# EAGLE design ccam (EAGLE 8.6.1)
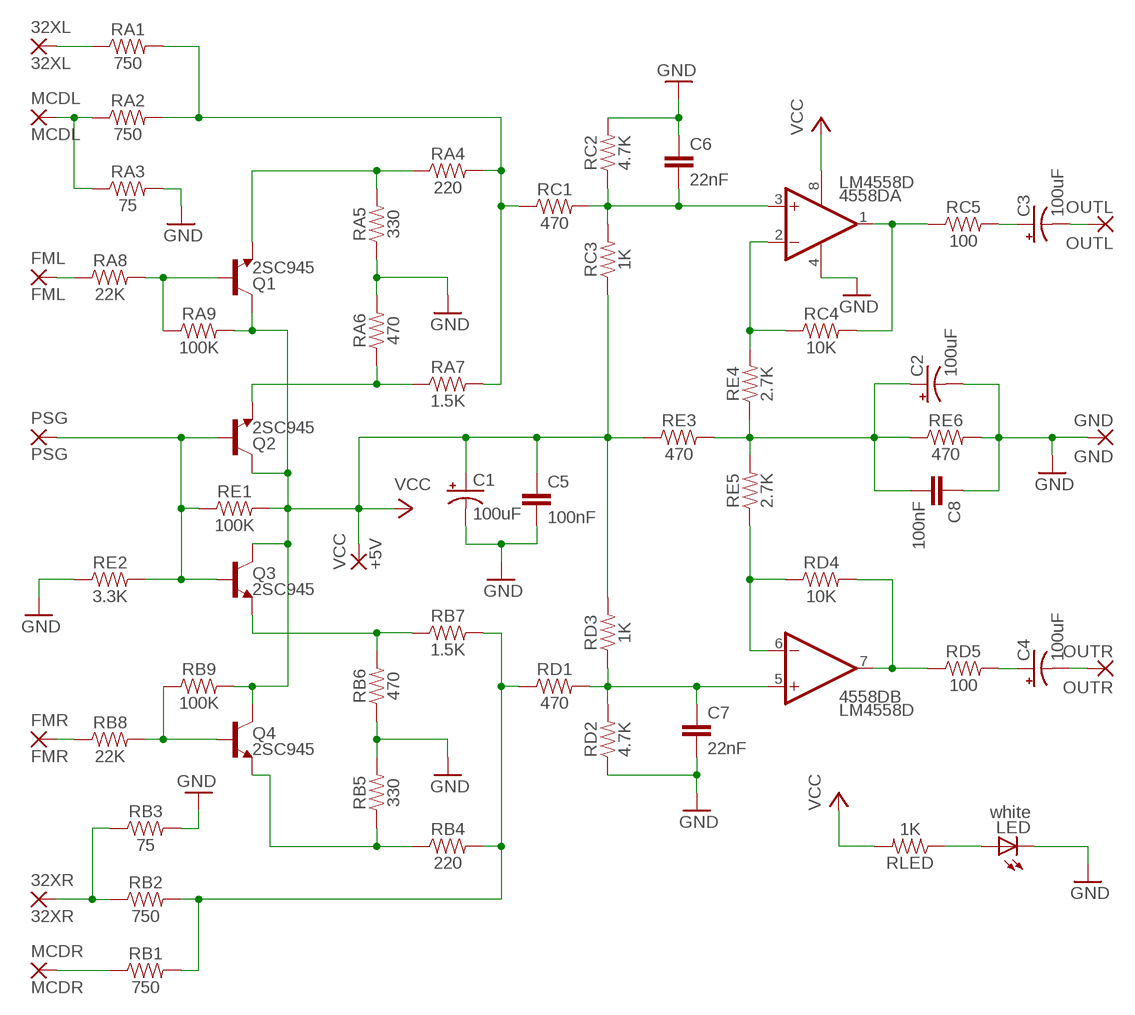
[diagram p0: schematic, sheet 1]

## Parts
32XL  32XL  SMD2  [SMD1,27-2,54]
32XR  32XR  SMD2  [SMD1,27-2,54]
4558D  LM4558D  [SO08]
C1  100uF  10UF-POLAR-EIA6032-25V-10%  [EIA6032-NOM]
C2  100uF  10UF-POLAR-EIA6032-25V-10%  [EIA6032-NOM]
C3  100uF  10UF-POLAR-EIA6032-25V-10%  [EIA6032-NOM]
C4  100uF  10UF-POLAR-EIA6032-25V-10%  [EIA6032-NOM]
C5  100nF  1.0UF-0805-25V-(+80/-20%)  [0805]
C6  22nF  1.0UF-0805-25V-(+80/-20%)  [0805]
C7  22nF  1.0UF-0805-25V-(+80/-20%)  [0805]
C8  100nF  1.0UF-0805-25V-(+80/-20%)  [0805]
FML  FML  SMD2  [SMD1,27-2,54]
FMR  FMR  SMD2  [SMD1,27-2,54]
GND  GND  SMD2  [SMD1,27-2,54]
LED  white  LEDCHIP-LED0805  [CHIP-LED0805]
MCDL  MCDL  SMD2  [SMD1,27-2,54]
MCDR  MCDR  SMD2  [SMD1,27-2,54]
OUTL  OUTL  SMD2  [SMD1,27-2,54]
OUTR  OUTR  SMD2  [SMD1,27-2,54]
PSG  PSG  SMD2  [SMD1,27-2,54]
Q1  2SC945  TRANS_NPN-MMBT2222AL  [SOT23-3]
Q2  2SC945  TRANS_NPN-MMBT2222AL  [SOT23-3]
Q3  2SC945  TRANS_NPN-MMBT2222AL  [SOT23-3]
Q4  2SC945  TRANS_NPN-MMBT2222AL  [SOT23-3]
RA1  750  0.22OHM-0805-1/4W-1%  [0805]
RA2  750  0.22OHM-0805-1/4W-1%  [0805]
RA3  75  0.22OHM-0805-1/4W-1%  [0805]
RA4  220  0.22OHM-0805-1/4W-1%  [0805]
RA5  330  0.22OHM-0805-1/4W-1%  [0805]
RA6  470  0.22OHM-0805-1/4W-1%  [0805]
RA7  1.5K  0.22OHM-0805-1/4W-1%  [0805]
RA8  22K  0.22OHM-0805-1/4W-1%  [0805]
RA9  100K  0.22OHM-0805-1/4W-1%  [0805]
RB1  750  0.22OHM-0805-1/4W-1%  [0805]
RB2  750  0.22OHM-0805-1/4W-1%  [0805]
RB3  75  0.22OHM-0805-1/4W-1%  [0805]
RB4  220  0.22OHM-0805-1/4W-1%  [0805]
RB5  330  0.22OHM-0805-1/4W-1%  [0805]
RB6  470  0.22OHM-0805-1/4W-1%  [0805]
RB7  1.5K  0.22OHM-0805-1/4W-1%  [0805]
RB8  22K  0.22OHM-0805-1/4W-1%  [0805]
RB9  100K  0.22OHM-0805-1/4W-1%  [0805]
RC1  470  0.22OHM-0805-1/4W-1%  [0805]
RC2  4.7K  0.22OHM-0805-1/4W-1%  [0805]
RC3  1K  0.22OHM-0805-1/4W-1%  [0805]
RC4  10K  0.22OHM-0805-1/4W-1%  [0805]
RC5  100  0.22OHM-0805-1/4W-1%  [0805]
RD1  470  0.22OHM-0805-1/4W-1%  [0805]
RD2  4.7K  0.22OHM-0805-1/4W-1%  [0805]
RD3  1K  0.22OHM-0805-1/4W-1%  [0805]
RD4  10K  0.22OHM-0805-1/4W-1%  [0805]
RD5  100  0.22OHM-0805-1/4W-1%  [0805]
RE1  100K  0.22OHM-0805-1/4W-1%  [0805]
RE2  3.3K  0.22OHM-0805-1/4W-1%  [0805]
RE3  470  0.22OHM-0805-1/4W-1%  [0805]
RE4  2.7K  0.22OHM-0805-1/4W-1%  [0805]
RE5  2.7K  0.22OHM-0805-1/4W-1%  [0805]
RE6  470  0.22OHM-0805-1/4W-1%  [0805]
RLED  1K  0.22OHM-0805-1/4W-1%  [0805]
VCC  +5V  SMD2  [SMD1,27-2,54]

## Nets
GND: 4558D.4(P:V-) C1.C(-) C2.C(-) C5.2 C6.1 C7.2 C8.1 GND.1(P) LED.C RA3.2 RA5.1 RA6.2 RB3.2 RB5.2 RB6.1 RC2.2 RD2.1 RE2.1 RE6.2
N$1: 32XL.1(P) RA1.1
N$2: MCDL.1(P) RA2.1 RA3.1
N$3: RA1.2 RA2.2 RA4.2 RA7.2 RC1.1
N$4: FML.1(P) RA8.1
N$5: Q1.1(B) RA8.2 RA9.1
N$6: Q4.1(B) RB8.2 RB9.1
N$7: PSG.1(P) Q2.1(B) Q3.1(B) RE1.1 RE2.2
N$8: Q1.2(E) RA4.1 RA5.2
N$9: FMR.1(P) RB8.1
N$10: Q2.2(E) RA6.1 RA7.1
N$11: MCDR.1(P) RB1.1
N$12: 32XR.1(P) RB2.1 RB3.1
N$13: RB1.2 RB2.2 RB4.2 RB7.2 RD1.1
N$14: Q3.2(E) RB6.2 RB7.1
N$15: 4558D.3(A:+IN) C6.2 RC1.2 RC2.1 RC3.2
N$16: Q4.2(E) RB4.1 RB5.1
N$17: 4558D.5(B:+IN) C7.1 RD1.2 RD2.2 RD3.1
N$18: 4558D.2(A:-IN) RC4.1 RE4.2
N$19: C2.A(+) C8.2 RE3.2 RE4.1 RE5.2 RE6.1
N$20: C4.A(+) RD5.2
N$21: 4558D.1(A:OUT) RC4.2 RC5.1
N$22: C3.A(+) RC5.2
N$23: C3.C(-) OUTL.1(P)
N$24: C4.C(-) OUTR.1(P)
N$25: LED.A RLED.1
N$26: 4558D.7(B:OUT) RD4.2 RD5.1
N$27: 4558D.6(B:-IN) RD4.1 RE5.1
VCC: 4558D.8(P:V+) C1.A(+) C5.1 Q1.3(C) Q2.3(C) Q3.3(C) Q4.3(C) RA9.2 RB9.2 RC3.1 RD3.2 RE1.2 RE3.1 RLED.2 VCC.1(P)

## Library data of the parts
32XL 32XR FML FMR GND MCDL MCDR OUTL OUTR PSG VCC = wirepad:SMD2: SMD PAD
4558D = linear:*4558: OP AMP
C1-C4 = SparkFun-Capacitors:10UF-POLAR: 10.0µF polarized capacitors A capacitor is a passive two-terminal electrical component used to store electrical energy temporarily in an electric field.; PROD_ID: CAP-12984; VALUE: 10µF
C5-C8 = SparkFun-Capacitors:1.0UF: 1µF ceramic capacitors A capacitor is a passive two-terminal electrical component used to store electrical energy temporarily in an electric field.; PROD_ID: CAP-11625; VALUE: 1.0uF
LED = led:LED: LED OSRAM: - CHIPLED LG R971, LG N971, LY N971, LG Q971, LY Q971, LO R971, LY R971 LH N974, LH R974 LS Q976, LO Q976, LY Q976 LO Q996 - Hyper CHIPLED LW Q18S LB Q993, LB Q99A, LB R99A - SideLED LS A670, LO A670, LY A670, LG A670, LP A670 LB A673, LV A673, LT A673, LW A673 LH A674 LY A675 LS A676, LA A676, LO A676, LY A676, LW A676 LS A679, LY A679, LG A679 - Hyper Micro SIDELED® LS Y876, LA Y876, LO Y876, LY Y876 LT Y87S - SmartLED LW L88C, LW L88S LB L89C, LB L89S, LG L890 LS L89K, LO L89K, LY L89K LS L896, LA L896, LO L896, LY L896 - TOPLED LS T670, LO T670, LY T670, LG T670, LP T670 LSG T670, LSP T670, LSY T670, LOP T670, LYG T670 LG T671, LOG T671, LSG T671 LB T673, LV T673, LT T673, LW T673 LH T674 LS T676, LA T676, LO T676, LY T676, LB T676, LH T676, LSB T676, LW T676 LB T67C, LV T67C, LT T67C, LS T67K, LO T67K, LY T67K, LW E67C LS E67B, LA E67B, LO E67B, LY E67B, LB E67C, LV E67C, LT E67C LW T67C LS T679, LY T679, LG T679 LS T770, LO T770, LY T770, LG T770, LP T770 LB T773, LV T773, LT T773, LW T773 LH T774 LS E675, LA E675, LY E675, LS T675 LS T776, LA T776, LO T776, LY T776, LB T776 LHGB T686 LT T68C, LB T68C - Hyper Mini TOPLED® LB M676 - Mini TOPLED Santana® LG M470 LS M47K, LO M47K, LY M47K Source: http://www.osram.convergy.de LUXEON: - LUMILED® LXK2-PW12-R00, LXK2-PW12-S00, LXK2-PW14-U00, LXK2-PW14-V00 LXK2-PM12-R00, LXK2-PM12-S00, LXK2-PM14-U00 LXK2-PE12-Q00, LXK2-PE12-R00, LXK2-PE12-S00, LXK2-PE14-T00, LXK2-PE14-U00 LXK2-PB12-K00, LXK2-PB12-L00, LXK2-PB12-M00, LXK2-PB14-N00, LXK2-PB14-P00, LXK2-PB14-Q00 LXK2-PR12-L00, LXK2-PR12-M00, LXK2-PR14-Q00, LXK2-PR14-R00 LXK2-PD12-Q00, LXK2-PD12-R00, LXK2-PD12-S00 LXK2-PH12-R00, LXK2-PH12-S00 LXK2-PL12-P00, LXK2-PL12-Q00, LXK2-PL12-R00 Source: www.luxeon.com KINGBRIGHT: KA-3528ASYC Source: www.kingbright.com
Q1-Q4 = SparkFun-DiscreteSemi:TRANS_NPN: NPN transistor Current controlled devices typically used to amplify current or used as a switch. BC547 - COM-08928 <http://www.sparkfun.com/products/8928> (TO-92 45V 100mA) (1.Collector 2.Base 3.Emitter) 2N3904 - COM-00521 <http://www.sparkfun.com/products/521> (TO-92 40V 200mA) (1.Emitter 2.Base 3.Collector) P2N2222A - COM-12852 <http://www.sparkfun.com/products/12852> (TO-92 40V 600mA) (1.Collector 2.Base 3.Emitter); PROD_ID: TRANS-08049; VALUE: 600mA/40V
RA1-RA9 RB1-RB9 RC1-RC5 RD1-RD5 RE1-RE6 RLED = SparkFun-Resistors:0.22OHM: 0.22Ω resistor A resistor is a passive two-terminal electrical component that implements electrical resistance as a circuit element. Resistors act to reduce current flow, and, at the same time, act to lower voltage levels within circuits. - Wikipedia; PROD_ID: RES-09883; VALUE: 0.22

## Board
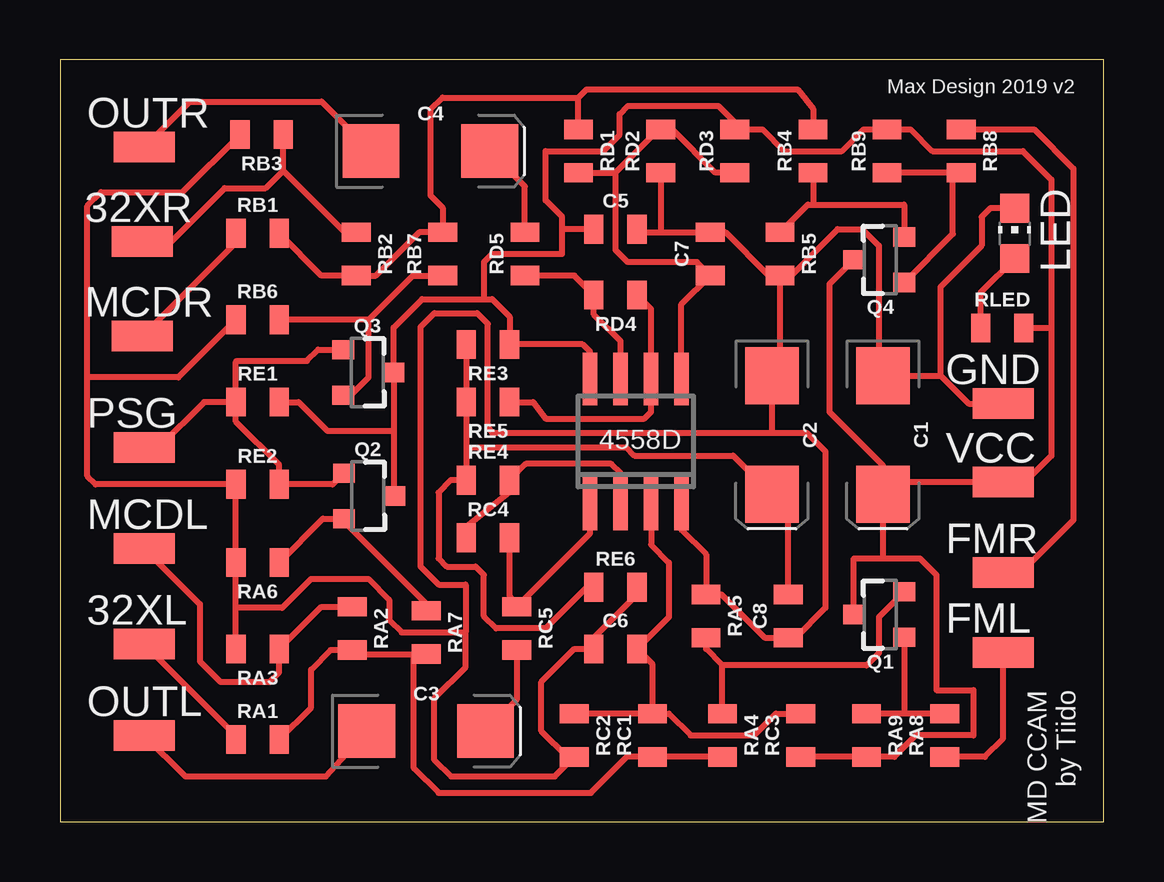
[diagram p1: board, top side]

Size 43.49 x 31.74 mm. Coordinates in mm from the lower left corner, seen from the top.
Outline: 0,0 43.49,0 43.49,31.74 0,31.74 0,0
Copper layers (1*16): Top 0.035mm / dielectric 1.5mm / Bottom 0.035mm
Design rules "default *": minimum track width 6mil, minimum drill 0.35mm, track to track 6mil, track to pad 6mil, pad to pad 6mil, via to via 6mil, smd to smd 6mil, copper to edge 40mil, drill to drill 6mil, minimum pad ring 10mil, minimum via ring 8mil, stop-mask expansion 4mil, vias tented up to drill 0mil, thermal gap 10mil

### Footprints (pad centres in the part's own frame; a part is rotated, then mirrored left to right if it is on the bottom)
SMD1,27-2,54 = smd 1.27 x 2.54: 1 0,0
SO08 = smd 0.6 x 2.2: 1 -1.905,-2.6; 2 -0.635,-2.6; 3 0.635,-2.6; 4 1.905,-2.6; 5 1.905,2.6; 6 0.635,2.6; 7 -0.635,2.6; 8 -1.905,2.6
EIA6032-NOM = smd 2.37 x 2.23: A 2.47,0; C -2.47,0
0805 = smd 0.8 x 1.2: 1 -0.9,0; 2 0.9,0
CHIP-LED0805 = smd 1.2 x 1.2: A 0,-1.05; C 0,1.05
SOT23-3 = smd 0.8 x 0.9: 1 -0.95,-1; 2 0.95,-1; 3 0,1.1

### Placement (x,y rotation side)
32XL  3.52,7.4 270 top
32XR  3.43,24.17 270 top
4558D  23.99,15.85 0 top
C1  34.29,16.12 270 top
C2  29.66,16.12 270 top
C3  15.26,3.77 0 top
C4  15.43,27.95 0 top
C5  23.15,24.69 0 top
C6  23.15,7.2 0 top
C7  27.09,23.66 90 top
C8  30.35,8.57 90 top
FML  39.3,7.05 270 top
FMR  39.3,10.38 270 top
GND  39.3,17.42 270 top
LED  39.78,24.52 0 top
MCDL  3.52,11.38 270 top
MCDR  3.43,20.23 270 top
OUTL  3.52,3.59 270 top
OUTR  3.52,28.11 270 top
PSG  3.52,15.6 270 top
Q1  34.18,8.64 90 top
Q2  12.83,13.58 270 top
Q3  12.8,18.72 270 top
Q4  34.18,23.42 90 top
RA1  8.23,3.43 0 top
RA2  12.17,8.06 270 top
RA3  8.23,7.2 180 top
RA4  27.6,3.6 270 top
RA5  26.92,8.57 270 top
RA6  8.23,10.8 180 top
RA7  15.26,7.89 270 top
RA8  36.86,3.6 90 top
RA9  33.6,3.6 270 top
RB1  8.23,24.52 0 top
RB2  12.34,23.66 270 top
RB3  8.4,28.63 180 top
RB4  31.38,27.95 90 top
RB5  30,23.66 270 top
RB6  8.23,20.92 0 top
RB7  15.94,23.66 90 top
RB8  37.55,27.95 270 top
RB9  34.46,27.95 90 top
RC1  24.69,3.6 90 top
RC2  21.43,3.6 270 top
RC3  30.86,3.6 90 top
RC4  17.83,11.83 0 top
RC5  19.03,8.06 270 top
RD1  21.6,27.95 270 top
RD2  25.03,27.95 90 top
RD3  28.12,27.95 90 top
RD4  23.15,21.95 180 top
RD5  19.37,23.66 90 top
RE1  8.23,17.49 0 top
RE2  8.23,14.06 0 top
RE3  17.83,19.89 180 top
RE4  17.83,14.23 0 top
RE5  17.83,17.49 180 top
RE6  23.15,9.77 0 top
RLED  39.26,20.57 0 top
VCC  39.3,14.15 270 top

### Tracks (layer width: path | path; a pad name or v marks a point on that pad's centre or on a via)
GND
  Top 0.152: 21.34,2.82 RC2.2 | 7.47,10.74 7.37,10.79 RA6.2 | 25.91,13.34 4558D.4
  Top 0.254: RA3.2 7.33,8.91 | 7.33,8.91 7.33,10.75 7.37,10.79 | 4558D.4 25.89,12.17 26.92,11.14 RA5.1 27.56,9.47 29.36,7.67 C8.1 30.65,7.67 31.89,8.91 31.89,15.43 31.12,16.2 29.66,16.2 | 7.33,8.91 9.26,8.91 10.46,10.12 12.86,10.12 13.72,9.26 13.72,8.4 14.23,7.89 16.9,7.89 | 1.14,18.52 1.14,14.4 1.49,14.06 RE2.1 RA6.2 | 1.14,18.52 1.14,25.66 1.71,26.23 5.1,26.23 RB3.2 | RB5.2 30,18.76 C2.C 29.66,16.2 | RB5.2 30.48,22.76 32.4,24.69 33.43,24.69 34.12,24 34.12,18.76 C1.C 36.69,18.59 | 1.14,18.52 4.93,18.52 RB6.1 | C5.2 24.35,24.56 25.03,24.56 | 25.03,24.56 C7.2 27.73,24.56 29.53,22.76 RB5.2 | RE6.2 24.05,9.47 22.29,7.71 22.29,7.24 C6.1 21.43,7.2 20.06,5.83 20.06,3.77 21.13,2.7 RC2.2 20.62,1.89 16.29,1.89 15.6,2.57 15.6,5.14 16.9,6.44 16.9,7.89 | 16.9,7.89 16.9,9.88 15.78,9.88 15.02,10.63 15.02,20.62 15.6,21.2 17.38,21.2 17.83,20.75 17.83,16.46 18,16.2 29.66,16.2 | RD2.1 25.03,24.56 | LED.C 38.77,25.57 38.41,25.2 38.41,24 36.69,22.29 36.69,18.59 | 36.69,18.59 37.86,17.42 GND.1
N$1
  Top 0.254: 32XL.1 7.33,3.59 RA1.1
N$2
  Top 0.254: MCDL.1 5.83,9.07 5.83,6.69 6.69,5.83 8.74,5.83 9.13,6.21 RA3.1 10.89,8.96 RA2.1
N$3
  Top 0.254: RA4.2 RC1.1 23.62,2.7 22.12,1.2 15.77,1.2 14.74,2.23 14.74,6.99 | RA1.2 10.46,4.76 10.46,6.34 11.27,7.16 RA2.2 12.34,6.99 14.74,6.99 | 14.74,6.99 RA7.2
N$4
  Top 0.254: RA8.1 38.53,2.7 39.3,3.47 FML.1
N$5
  Top 0.152: 35.05,7.54 Q1.1
  Top 0.254: RA8.2 35.15,4.5 | 35.15,4.5 RA9.1 | Q1.1 35.18,4.53 35.15,4.5
N$6
  Top 0.254: RB8.2 37.2,27.05 | 37.2,27.05 RB9.1 | Q4.1 37.2,24.5 37.2,27.05
N$7
  Top 0.254: RE1.1 7.33,19.16 7.37,19.2 10.29,19.2 10.75,19.67 Q3.1 | RE1.1 7.33,16.67 9.13,14.87 RE2.2 11.36,14.06 Q2.1 | RE1.1 6.26,17.49 6,17.49 4.12,15.6 PSG.1
N$8
  Top 0.152: 35.05,9.53 Q1.2
  Top 0.254: Q1.2 34.12,8.53 34.12,7.03 33.6,6.51 27.6,6.51 | RA4.1 27.6,6.51 | 27.6,6.51 26.92,7.2 RA5.2
N$9
  Top 0.254: RB8.1 40.59,28.85 42.23,27.21 42.23,12.57 40.04,10.38 FMR.1
N$10
  Top 0.254: RA6.1 10.96,12.63 Q2.2 11.83,12.52 15.26,9.09 RA7.1
N$11
  Top 0.254: MCDR.1 7.33,24.13 RB1.1
N$12
  Top 0.254: 32XR.1 4.63,24.17 6.86,26.4 8.57,26.4 9.3,27.13 | 9.3,27.13 RB3.1 | RB2.1 11.87,24.56 9.3,27.13
N$13
  Top 0.254: RB1.2 10.89,22.76 RB2.2 13.16,22.76 14.96,24.56 RB7.2 15.95,25.59 15.43,26.1 15.43,29.66 15.95,30.18 21.6,30.18 | RD1.1 21.6,30.18 | RB4.2 31.38,29.7 30.73,30.52 21.95,30.52 21.6,30.18
N$14
  Top 0.254: Q3.2 12.11,17.77 12.86,18.52 12.86,20.92 | 12.86,20.92 RB6.2 | 12.86,20.92 14.7,22.76 RB7.1
N$15
  Top 0.254: RC1.2 RC2.1 | RC1.2 24.69,6.56 C6.2 25.38,8.53 25.38,10.8 24.62,11.55 4558D.3 | RC3.2 29.83,4.5 28.93,3.6 26.27,3.6 25.38,4.5 RC1.2
N$16
  Top 0.254: Q4.2 35.18,25.72 31.38,25.72 | RB5.1 31.16,25.72 31.38,25.72 | RB4.1 31.38,25.72
N$17
  Top 0.254: RD3.1 27.3,27.05 25.5,28.85 RD2.2 24.95,28.85 23.15,27.05 | 4558D.5 25.89,21.57 C7.1 26.53,23.32 23.66,23.32 23.15,23.83 23.15,27.05 | RD1.2 23.15,27.05
N$18
  Top 0.254: 4558D.2 23.36,14.54 22.97,14.92 19.42,14.92 RE4.2 18.73,13.76 16.93,12.3 RC4.1
N$19
  Top 0.254: 16.93,15.6 RE5.2 RE3.2 | 16.93,15.6 RE4.1 16.29,14.23 15.77,13.72 15.77,10.97 16.12,10.63 17.32,10.63 17.66,10.29 17.66,8.57 18.17,8.06 20.23,8.06 21.95,9.77 RE6.1 | 16.93,15.6 23.59,15.6 23.93,15.26 28.05,15.26 C2.A 30.35,13.13 C8.2
N$20
  Top 0.254: RD5.2 19.37,26.47 C4.A
N$21
  Top 0.254: 4558D.1 22.09,12.01 RC5.1 18.73,9.43 RC4.2
N$22
  Top 0.254: RC5.2 19.03,5.07 C3.A
N$23
  Top 0.254: OUTL.1 5.22,1.89 11.07,1.89 C3.C
N$24
  Top 0.254: OUTR.1 5.41,30 10.9,30 C4.C
N$25
  Top 0.254: RLED.1 38.36,22.05 LED.A
N$26
  Top 0.254: 4558D.7 23.36,20.02 22.25,21.13 RD4.2 21.43,22.76 RD5.1
N$27
  Top 0.254: RD4.1 24.62,21.37 4558D.6 24.62,17.08 24.35,16.8 20.23,16.8 19.72,17.49 RE5.1
VCC
  Top 0.152: 33.22,8.76 Q1.3
  Top 0.254: Q1.3 33.08,10.97 34.29,10.97 | 34.29,10.97 35.83,10.97 36.52,10.29 36.52,5.49 38.06,5.49 38.06,3.6 35.66,3.6 34.76,2.7 RA9.2 RC3.1 | RE1.2 9.94,17.49 11.14,16.29 13.93,16.29 | 20.92,24.69 20.92,23.66 18,23.66 17.66,23.32 17.66,21.77 | 20.92,24.69 20.92,25.2 20.23,25.89 20.23,27.95 22.63,27.95 23.32,28.63 23.32,29.49 23.66,29.83 27.43,29.83 28.12,29.15 RD3.2 29.27,28.85 30.18,27.95 32.58,27.95 33.48,28.85 RB9.2 35.45,28.85 36.35,27.95 40.12,27.95 41.31,26.76 41.31,20.57 | 17.66,21.77 15.09,21.77 13.9,20.59 Q3.3 13.93,18.69 13.93,16.29 | 17.66,21.77 18,21.77 18.73,21.05 RE3.1 21.77,19.89 22.09,19.58 4558D.8 | Q4.3 32.06,22.4 32.06,17.07 34.29,14.85 34.29,13.72 | 34.29,13.72 C1.A 34.29,10.97 | 41.31,20.57 41.31,15.25 40.21,14.15 VCC.1 34.72,14.15 34.29,13.72 | C5.1 20.92,24.69 | Q2.3 13.93,16.29 | RLED.2 41.31,20.57

### Text on the board
tNames: Max Design 2019 v2 | MD CCAM / by Tiido